# Altium schematic sheet P05_POWER02.SchDoc
size 420 x 297 mm
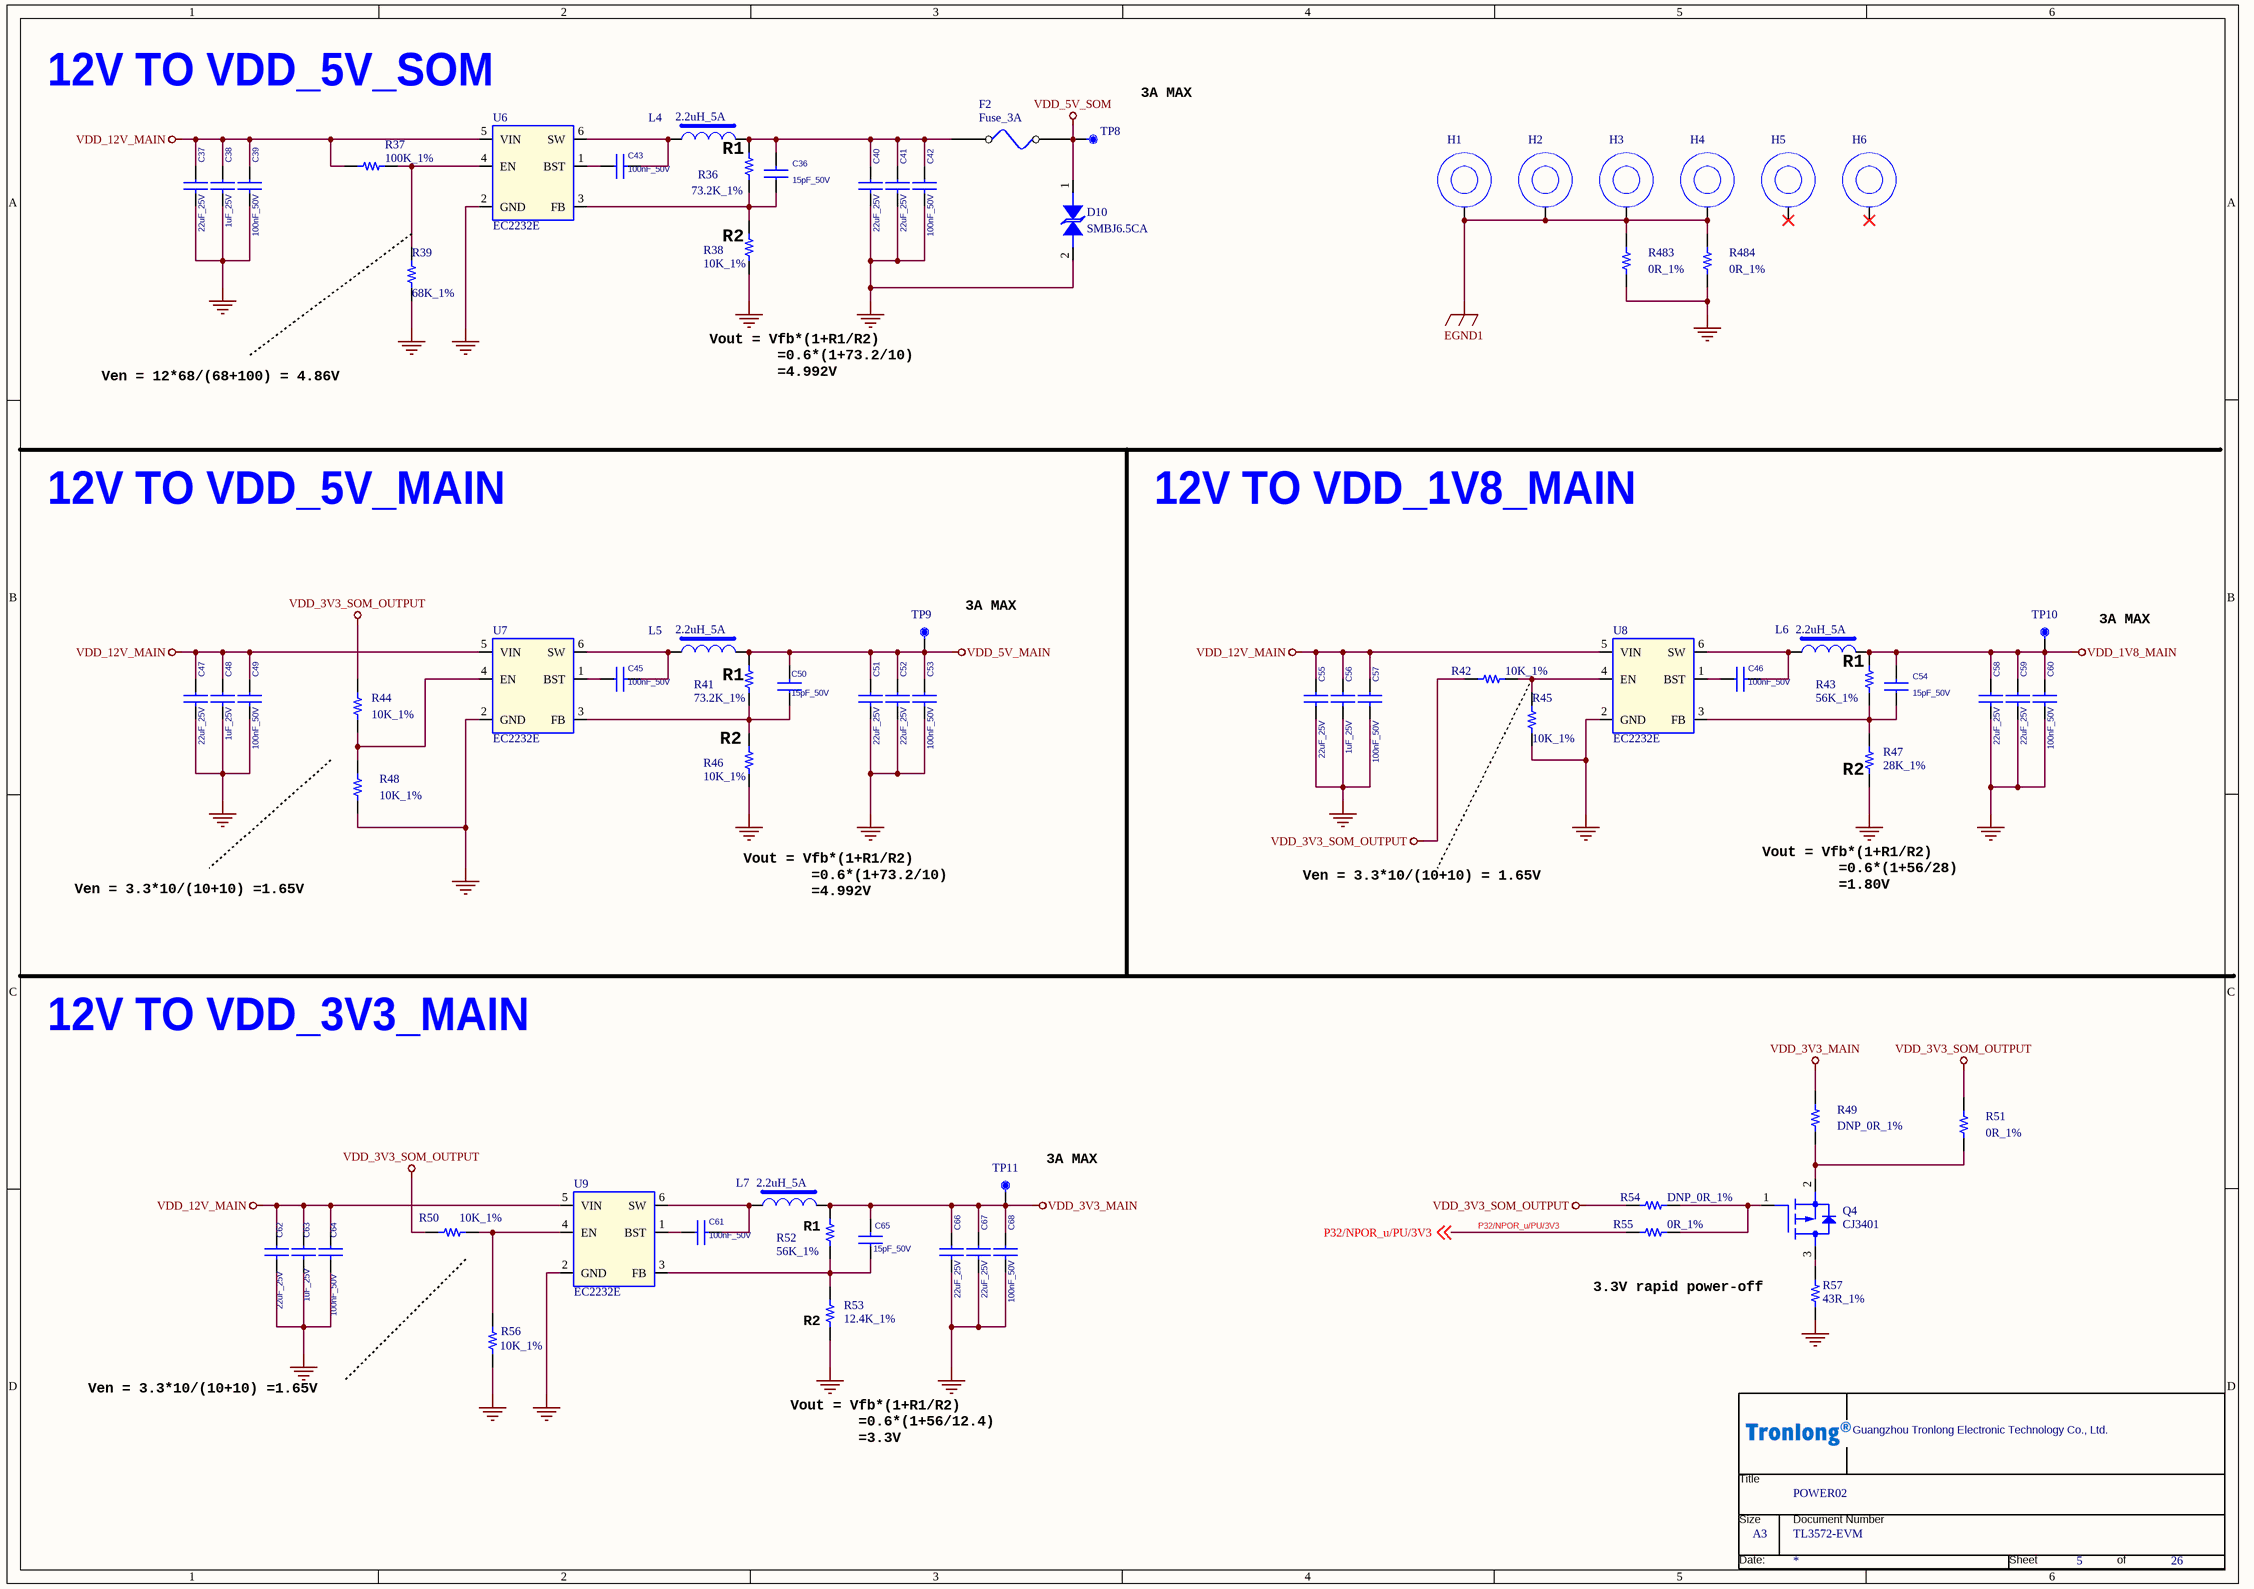
[diagram p0: P05_POWER02.SchDoc]

## Parts
*  Doc: TL3572-EVM  Title: POWER02  OrgName: Guangzhou Tronlong Electronic Technology Co., Ltd.  Page Size: A3  Page Number: 5  Page Count: 26  (hidden comment: Tronlong_TITTLE_20211115)  (graphical)
C36  15pF_50V  [C0603]
C37  22uF_25V  [C0805]
C38  1uF_25V  [C0402]
C39  100nF_50V  [C0402]
C40  22uF_25V  [C0805]
C41  22uF_25V  [C0805]
C42  100nF_50V  [C0402]
C43  100nF_50V  [C0402]
C45  100nF_50V  [C0402]
C46  100nF_50V  [C0402]
C47  22uF_25V  [C0805]
C48  1uF_25V  [C0402]
C49  100nF_50V  [C0402]
C50  15pF_50V  [C0603]
C51  22uF_25V  [C0805]
C52  22uF_25V  [C0805]
C53  100nF_50V  [C0402]
C54  15pF_50V  [C0603]
C55  22uF_25V  [C0805]
C56  1uF_25V  [C0402]
C57  100nF_50V  [C0402]
C58  22uF_25V  [C0805]
C59  22uF_25V  [C0805]
C60  100nF_50V  [C0402]
C61  100nF_50V  [C0402]
C62  22uF_25V  [C0805]
C63  1uF_25V  [C0402]
C64  100nF_50V  [C0402]
C65  15pF_50V  [C0603]
C66  22uF_25V  [C0805]
C67  22uF_25V  [C0805]
C68  100nF_50V  [C0402]
D10  SMBJ6.5CA  [SMB]
F2  Fuse_3A  [F1206]
H1  HOLE  [MHOLE_C200D125]  (value not drawn)
H2  HOLE  [MHOLE_C200D125]  (value not drawn)
H3  HOLE  [MHOLE_C200D125]  (value not drawn)
H4  HOLE  [MHOLE_C200D125]  (value not drawn)
H5  HOLE  [MHOLE_C200D125]  (value not drawn)
H6  HOLE  [MHOLE_C200D125]  (value not drawn)
L4  2.2uH_5A  [SMD-L4040M-2P]
L5  2.2uH_5A  [SMD-L4040M-2P]
L6  2.2uH_5A  [SMD-L4040M-2P]
L7  2.2uH_5A  [SMD-L4040M-2P]
Q4  CJ3401  [SOT23-3]
R36  73.2K_1%  [R0402]
R37  100K_1%  [R0402]
R38  10K_1%  [R0402]
R39  68K_1%  [R0402]
R41  73.2K_1%  [R0402]
R42  10K_1%  [R0402]
R43  56K_1%  [R0402]
R44  10K_1%  [R0402]
R45  10K_1%  [R0402]
R46  10K_1%  [R0402]
R47  28K_1%  [R0402]
R48  10K_1%  [R0402]
R49  DNP_0R_1%  [R0603]
R50  10K_1%  [R0402]
R51  0R_1%  [R0603]
R52  56K_1%  [R0402]
R53  12.4K_1%  [R0402]
R54  DNP_0R_1%  [R0402]
R55  0R_1%  [R0402]
R56  10K_1%  [R0402]
R57  43R_1%  [R0805]
R483  0R_1%  [R1206]
R484  0R_1%  [R1206]
TP8  SMT TP  [TP30]  (value not drawn)
TP9  SMT TP  [TP30]  (value not drawn)
TP10  SMT TP  [TP30]  (value not drawn)
TP11  SMT TP  [TP30]  (value not drawn)
U6  EC2232E  [SOT-23-6L]
U7  EC2232E  [SOT-23-6L]
U8  EC2232E  [SOT-23-6L]
U9  EC2232E  [SOT-23-6L]

## Nets
EGND1: H1.1 H2.1 H3.1 H4.1 R483.2 R484.2
GND: C37.2 C38.2 C39.2 C40.2 C41.2 C42.2 C47.2 C48.2 C49.2 C51.2 C52.2 C53.2 C55.2 C56.2 C57.2 C58.2 C59.2 C60.2 C62.2 C63.2 C64.2 C66.2 C67.2 C68.2 D10.2 R38.1 R39.1 R45.1 R46.1 R47.1 R48.1 R53.1 R56.1 R57.2 R483.1 R484.1 U6.2(GND) U7.2(GND) U8.2(GND) U9.2(GND)
VDD_1V8_MAIN: C54.2 C58.1 C59.1 C60.1 L6.2 R43.2 TP10.1
VDD_3V3_MAIN: C65.2 C66.1 C67.1 C68.1 L7.2 R49.2 R52.2 TP11.1
VDD_3V3_SOM_OUTPUT: R42.1 R44.2 R50.2 R51.2 R54.2
VDD_5V_MAIN: C50.2 C51.1 C52.1 C53.1 L5.2 R41.2 TP9.1
VDD_5V_SOM: D10.1 F2.2 TP8.1
VDD_12V_MAIN: C37.1 C38.1 C39.1 C47.1 C48.1 C49.1 C55.1 C56.1 C57.1 C62.1 C63.1 C64.1 R37.1 U6.5(VIN) U7.5(VIN) U8.5(VIN) U9.5(VIN)
P32/NPOR_u/PU/3V3: R55.2 ; off-sheet P32/NPOR_u/PU/3V3
NetC36_1: C36.1 R36.1 R38.2 U6.3(FB)
NetC36_2: C36.2 C40.1 C41.1 C42.1 F2.1 L4.2 R36.2
NetC43_1: C43.1 U6.1(BST)
NetC43_2: C43.2 L4.1 U6.6(SW)
NetC45_1: C45.1 U7.1(BST)
NetC45_2: C45.2 L5.1 U7.6(SW)
NetC46_1: C46.1 U8.1(BST)
NetC46_2: C46.2 L6.1 U8.6(SW)
NetC50_1: C50.1 R41.1 R46.2 U7.3(FB)
NetC54_1: C54.1 R43.1 R47.2 U8.3(FB)
NetC61_1: C61.1 U9.1(BST)
NetC61_2: C61.2 L7.1 U9.6(SW)
NetC65_1: C65.1 R52.1 R53.2 U9.3(FB)
NetQ4_1: Q4.1(GATE) R54.1 R55.1
NetQ4_2: Q4.2(SOURCE) R49.1 R51.1
NetQ4_3: Q4.3(DRAIN) R57.1
NetR37_2: R37.2 R39.2 U6.4(EN)
NetR42_2: R42.2 R45.2 U8.4(EN)
NetR44_1: R44.1 R48.2 U7.4(EN)
NetR50_1: R50.1 R56.2 U9.4(EN)

Not connected (* = marked no-connect by the designer): H5 1*; H6 1*

## Notes on the sheet
- 12V TO VDD_5V_SOM
- 3A MAX
- (near L4) R1
- (near R38) R2
- Ven = 12*68/(68+100) = 4.86V
- Vout = Vfb*(1+R1/R2)
  =0.6*(1+73.2/10)
  =4.992V
- 12V TO VDD_5V_MAIN
- 12V TO VDD_1V8_MAIN
- (near TP9) 3A MAX
- (near L6) R1
- R1
- (near R46) R2
- (near R47) R2
- Ven = 3.3*10/(10+10) =1.65V
- Ven = 3.3*10/(10+10) = 1.65V
- Vout = Vfb*(1+R1/R2)
  =0.6*(1+56/28)
  =1.80V
- 12V TO VDD_3V3_MAIN
- (near TP11) 3A MAX
- (near R53) R2
- 3.3V rapid power-off
- Vout = Vfb*(1+R1/R2)
  =0.6*(1+56/12.4)
  =3.3V
- (in symbol Tronlong_TITTLE_20211115) Title; Size; Document Number; Date:; Sheet; of

## Library data of the parts
* = Tronlong_TITTLE_20211115: RevCode: A?; Page Create Date: March  8, 1995; Page Modify Date: *
C36 C50 = CAP NP_Dup2: CL10C150JB8NNNC,CC0603JRNPO9BN150; Manufacturer: 广州创龙; Manufacturer PartNumber: 15pF,5%,C0603,50V,（X7R,X5R,COG,NPO或X7S）; Eco-Label: ROHS; ERP Number: 005.0001.0022.00126; Operation Temperature（℃）: -40~+85(Ta); As-Welded: /; PCB Footprint: C0603; Part Status: -; Manufacturer Character: -; Temperature: -55~125℃
C37 = CAP NP_Dup2: 贴片陶瓷电容,22uF,20%,25V,X5R; Manufacturer Character: 中国大陆; Manufacturer: 广东风华高新科技股份有限公司（FH）; Manufacturer PartNumber: 0805X226M250NT; Eco-Label: ROHS; ERP Number: 005.0001.0001.00524; Operation Temperature（℃）: -55~+85(Ta); As-Welded: /; PCB Footprint: C0805; Part Status: 优选; Temperature: -55~125℃
C38 = CAP NP_Dup2: 贴片陶瓷电容,1uF,10%,25V,X5R; Manufacturer PartNumber: 0402X105K250NT; Manufacturer: 广东风华高新科技股份有限公司（FH）; Manufacturer Character: 中国大陆; Eco-Label: ROHS; ERP Number: 005.0001.0001.00640; As-Welded: /; Operation Temperature（℃）: -55~+85(Ta); PCB Footprint: C0402; Part Status: 试用
C39 C43 = CAP NP_Dup2: 贴片陶瓷电容,100nF,10%,50V,X7R; Manufacturer: 广东风华高新科技股份有限公司（FH）; Manufacturer PartNumber: 0402B104K500NT; Manufacturer Character: 中国大陆; As-Welded: /; Operation Temperature（℃）: -55~+125(Ta); ERP Number: 005.0001.0001.00681; Eco-Label: ROHS; PCB Footprint: C0402; Temperature: -55~125℃; Part Status: 试用
C40 C41 C51 = CAP NP_Dup2: 贴片陶瓷电容,22uF,20%,25V,X5R; Manufacturer Character: 中国大陆; Manufacturer PartNumber: 0805X226M250NT; Manufacturer: 广东风华高新科技股份有限公司（FH）; Eco-Label: ROHS; ERP Number: 005.0001.0001.00524; Operation Temperature（℃）: -55~+85(Ta); As-Welded: /; PCB Footprint: C0805; Part Status: 优选; Temperature: -55~125℃
C42 C49 C53 = CAP NP_Dup2: 贴片陶瓷电容,100nF,10%,50V,X7R; Manufacturer Character: 中国大陆; Manufacturer: 广东风华高新科技股份有限公司（FH）; Manufacturer PartNumber: 0402B104K500NT; As-Welded: /; Operation Temperature（℃）: -55~+125(Ta); ERP Number: 005.0001.0001.00681; Eco-Label: ROHS; PCB Footprint: C0402; Temperature: -55~125℃; Part Status: 试用
C45 = CAP NP_Dup2: 贴片陶瓷电容,100nF,10%,50V,X7R; Manufacturer Character: 中国大陆; Manufacturer PartNumber: 0402B104K500NT; Manufacturer: 广东风华高新科技股份有限公司（FH）; As-Welded: /; Operation Temperature（℃）: -55~+125(Ta); ERP Number: 005.0001.0001.00681; Eco-Label: ROHS; PCB Footprint: C0402; Temperature: -55~125℃; Part Status: 试用
C46 = CAP NP_Dup2: 贴片陶瓷电容,100nF,10%,50V,X7R; Manufacturer Character: 中国大陆; Manufacturer: 广东风华高新科技股份有限公司（FH）; Manufacturer PartNumber: 0402B104K500NT; Eco-Label: ROHS; ERP Number: 005.0001.0001.00681; Characteristic: <Characteristic>; Operation Temperature（℃）: -55~+125(Ta); As-Welded: /; PCB Footprint: C0402; Temperature: -55~155℃; Part Status: 试用
C47 C52 = CAP NP_Dup2: 贴片陶瓷电容,22uF,20%,25V,X5R; Manufacturer: 广东风华高新科技股份有限公司（FH）; Manufacturer PartNumber: 0805X226M250NT; Manufacturer Character: 中国大陆; Eco-Label: ROHS; ERP Number: 005.0001.0001.00524; Operation Temperature（℃）: -55~+85(Ta); As-Welded: /; PCB Footprint: C0805; Part Status: 优选; Temperature: -55~125℃
C48 = CAP NP_Dup2: 贴片陶瓷电容,1uF,10%,25V,X5R; Manufacturer Character: 中国大陆; Manufacturer PartNumber: 0402X105K250NT; Manufacturer: 广东风华高新科技股份有限公司（FH）; Eco-Label: ROHS; ERP Number: 005.0001.0001.00640; As-Welded: /; Operation Temperature（℃）: -55~+85(Ta); PCB Footprint: C0402; Part Status: 试用
C54 = CAP NP_Dup2: CL10C150JB8NNNC,CC0603JRNPO9BN150; Manufacturer PartNumber: 15pF,5%,C0603,50V,（X7R,X5R,COG,NPO或X7S）; Manufacturer: 广州创龙; As-Welded: /; Operation Temperature（℃）: -40~+85(Ta); ERP Number: 005.0001.0022.00126; Eco-Label: ROHS; PCB Footprint: C0603; Part Status: -; Temperature: -55~125℃; Manufacturer Character: -
C55 = CAP NP_Dup2: 贴片陶瓷电容,22uF,20%,25V,X5R; Manufacturer: 广东风华高新科技股份有限公司（FH）; Manufacturer PartNumber: 0805X226M250NT; Manufacturer Character: 中国大陆; As-Welded: /; Operation Temperature（℃）: -55~+85(Ta); Characteristic: <Characteristic>; ERP Number: 005.0001.0001.00524; Eco-Label: ROHS; PCB Footprint: C0805; Part Status: 优选; Temperature: -55~155℃
C56 = CAP NP_Dup2: 贴片陶瓷电容,1uF,10%,25V,X5R; Manufacturer PartNumber: 0402X105K250NT; Manufacturer: 广东风华高新科技股份有限公司（FH）; Manufacturer Character: 中国大陆; As-Welded: /; Operation Temperature（℃）: -55~+85(Ta); Characteristic: <Characteristic>; ERP Number: 005.0001.0001.00640; Eco-Label: ROHS; PCB Footprint: C0402; Part Status: 试用
C57 C60 = CAP NP_Dup2: 贴片陶瓷电容,100nF,10%,50V,X7R; Manufacturer PartNumber: 0402B104K500NT; Manufacturer: 广东风华高新科技股份有限公司（FH）; Manufacturer Character: 中国大陆; Eco-Label: ROHS; ERP Number: 005.0001.0001.00681; Operation Temperature（℃）: -55~+125(Ta); Characteristic: <Characteristic>; As-Welded: /; PCB Footprint: C0402; Temperature: -55~155℃; Part Status: 试用
C58 C59 = CAP NP_Dup2: 贴片陶瓷电容,22uF,20%,25V,X5R; Manufacturer: 广东风华高新科技股份有限公司（FH）; Manufacturer PartNumber: 0805X226M250NT; Manufacturer Character: 中国大陆; As-Welded: /; Operation Temperature（℃）: -55~+85(Ta); ERP Number: 005.0001.0001.00524; Eco-Label: ROHS; PCB Footprint: C0805; Part Status: 优选; Temperature: -55~125℃
C61 = CAP NP_Dup2: 贴片陶瓷电容,100nF,10%,50V,X7R; Manufacturer Character: 中国大陆; Manufacturer PartNumber: 0402B104K500NT; Manufacturer: 广东风华高新科技股份有限公司（FH）; Eco-Label: ROHS; ERP Number: 005.0001.0001.00681; Operation Temperature（℃）: -55~+125(Ta); As-Welded: /; PCB Footprint: C0402; Temperature: -55~125℃; Part Status: 试用
C62 C66 C67 = CAP NP_Dup2: 贴片陶瓷电容,22uF,20%,25V,X5R; Manufacturer Character: 中国大陆; Manufacturer PartNumber: 0805X226M250NT; Manufacturer: 广东风华高新科技股份有限公司（FH）; As-Welded: /; Operation Temperature（℃）: -55~+85(Ta); ERP Number: 005.0001.0001.00524; Eco-Label: ROHS; PCB Footprint: C0805; Part Status: 优选; Temperature: -55~125℃
C63 = CAP NP_Dup2: 贴片陶瓷电容,1uF,10%,25V,X5R; Manufacturer PartNumber: 0402X105K250NT; Manufacturer: 广东风华高新科技股份有限公司（FH）; Manufacturer Character: 中国大陆; As-Welded: /; Operation Temperature（℃）: -55~+85(Ta); ERP Number: 005.0001.0001.00640; Eco-Label: ROHS; PCB Footprint: C0402; Part Status: 试用
C64 = CAP NP_Dup2: 贴片陶瓷电容,100nF,10%,50V,X7R; Manufacturer Character: 中国大陆; Manufacturer: 广东风华高新科技股份有限公司（FH）; Manufacturer PartNumber: 0402B104K500NT; Eco-Label: ROHS; ERP Number: 005.0001.0001.00681; Operation Temperature（℃）: -55~+125(Ta); As-Welded: /; PCB Footprint: C0402; Temperature: -55~125℃; Part Status: 试用
C65 = CAP NP_Dup2: CL10C150JB8NNNC,CC0603JRNPO9BN150; Manufacturer: 广州创龙; Manufacturer PartNumber: 15pF,5%,C0603,50V,（X7R,X5R,COG,NPO或X7S）; As-Welded: /; Operation Temperature（℃）: -40~+85(Ta); ERP Number: 005.0001.0022.00126; Eco-Label: ROHS; PCB Footprint: C0603; Part Status: -; Manufacturer Character: -; Temperature: -55~125℃
C68 = CAP NP_Dup2: 贴片陶瓷电容,100nF,10%,50V,X7R; Manufacturer PartNumber: 0402B104K500NT; Manufacturer: 广东风华高新科技股份有限公司（FH）; Manufacturer Character: 中国大陆; Eco-Label: ROHS; ERP Number: 005.0001.0001.00681; Operation Temperature（℃）: -55~+125(Ta); As-Welded: /; PCB Footprint: C0402; Temperature: -55~125℃; Part Status: 试用
D10 = DIODE TVS BI-DIR: TVS二极管,VRWM=6.5V,VBR=7.22V,一组,双向; Manufacturer Character: 中国大陆; Manufacturer: 上海雷卯电子科技有限公司（Leiditech）; Operation Temperature（℃）: -55~+150(Tj); room: 6; ERP Number: 005.0001.0017.00087; Eco-Label: ROHS; As-Welded: /; PCB Footprint: SMB; Manufacturer PartNumber: SMBJ6.5CA; Part Status: 测评
F2 = FUSE: 保险丝，Vmax=72V,Imax=50A,Ihold=3A; Manufacturer Character: 中国大陆; Manufacturer: 东莞市竞沃电子科技有限公司（TLC）; Manufacturer PartNumber: F12T3; Eco-Label: ROHS; ERP Number: 005.0001.0011.00036; Operation Temperature（℃）: -55~+125(Ta); As-Welded: /; PCB Footprint: F1206; Part Status: 试用; Temperature: -55~125℃
H1-H6 = HOLE: Manufacturer Character: 中国大陆; Operation Temperature（℃）: /; As-Welded: DNP; PCB Footprint: MHOLE_C200D125
L4 = INDUCTOR: 贴片功率电感,2.2uH,0.048Ω,Isat=7.6A,Irms=5A; Manufacturer Character: 中国大陆; Manufacturer: 深圳顺络电子股份有限公司（Sunlord）; Manufacturer PartNumber: WPN4020H2R2MT; Parameter: L2520，奇力新一体成型电感，最大额定电流3A，内阻65毫欧，20%; Eco-Label: ROHS; ERP Number: 005.0001.0006.00163; As-Welded: /; Operation Temperature（℃）: -40~+125(Ta); PCB Footprint: SMD-L4040M-2P; Part Status: 试用; Temperature: -40~125℃
L5 = INDUCTOR: 贴片功率电感,2.2uH,0.048Ω,Isat=7.6A,Irms=5A; Manufacturer PartNumber: WPN4020H2R2MT; Manufacturer: 深圳顺络电子股份有限公司（Sunlord）; Manufacturer Character: 中国大陆; Parameter: L2520，奇力新一体成型电感，最大额定电流3A，内阻65毫欧，20%; Eco-Label: ROHS; ERP Number: 005.0001.0006.00163; Operation Temperature（℃）: -40~+125(Ta); As-Welded: /; PCB Footprint: SMD-L4040M-2P; Part Status: 试用; Temperature: -40~125℃
L6 L7 = INDUCTOR: 贴片功率电感,2.2uH,0.048Ω,Isat=7.6A,Irms=5A; Manufacturer PartNumber: WPN4020H2R2MT; Manufacturer: 深圳顺络电子股份有限公司（Sunlord）; Manufacturer Character: 中国大陆; Parameter: L2520，奇力新一体成型电感，最大额定电流3A，内阻65毫欧，20%; Operation Temperature（℃）: -40~+125(Ta); As-Welded: /; ERP Number: 005.0001.0006.00163; Eco-Label: ROHS; PCB Footprint: SMD-L4040M-2P; Part Status: 试用; Temperature: -40~125℃
Q4 = MOSFET P SOT: MOSFET,P沟道,VDSS=-30V,VGSS=±12V,ID=-4.2A,PD=0.35W,VGS(th)=-1.3V; Manufacturer Character: 中国大陆; Manufacturer: 江苏长晶科技股份有限公司（JSCJ）; As-Welded: /; Operation Temperature（℃）: -55~+150(Tj); room: DCIN; ERP Number: 005.0001.0009.00015; Eco-Label: ROHS; PCB Footprint: SOT23-3; Manufacturer PartNumber: CJ3401; Manufacturer Part Number: CJ3401; Temperature: -55~150℃; Part Status: 优选
R36 = Resistor_Dup3: RC0402FR-0773K2L,0402WGF7322TCE,RTT027322FTH; Manufacturer: 广州创龙; Manufacturer PartNumber: 73.2K,±1%,R0402,≥1/16W; CLASS: DISCRETE; As-Welded: /; Operation Temperature（℃）: -40~+85(Ta); ERP Number: 005.0001.0023.00234; Eco-Label: ROHS; PCB Footprint: R0402; Part Status: -; Temperature: -55~155℃; Manufacturer Character: -
R37 = Resistor_Dup3: RC0402FR-07100KL,0402WGF1003TCE; Manufacturer: 广州创龙; Manufacturer PartNumber: 100K,±1%,R0402,≥1/16W; CLASS: DISCRETE; Eco-Label: ROHS; ERP Number: 005.0001.0023.00025; Operation Temperature（℃）: -40~+85(Ta); As-Welded: /; PCB Footprint: R0402; Part Status: -; Manufacturer Character: -; Temperature: -55~155℃
R38 R44-R46 R48 = Resistor_Dup3: 贴片电阻,10K,±1%,1/16W; Manufacturer PartNumber: RC-02K1002FT; Manufacturer: 广东风华高新科技股份有限公司（FH）; Manufacturer Character: 中国大陆; CLASS: DISCRETE; Eco-Label: ROHS; ERP Number: 005.0001.0002.01326; Operation Temperature（℃）: -55~+125(Ta); As-Welded: /; PCB Footprint: R0402; Part Status: 优选
  R38 R45 R46: Temperature: -55~155℃
  R44 R48: Temperature: –55~155℃
R39 = Resistor_Dup3: 贴片电阻,68K,±1%,1/16W; Manufacturer Character: 中国大陆; Manufacturer PartNumber: RC-02K6802FT; Manufacturer: 广东风华高新科技股份有限公司（FH）; CLASS: DISCRETE; Eco-Label: ROHS; ERP Number: 005.0001.0002.01426; Operation Temperature（℃）: -55~+155(Ta); As-Welded: /; PCB Footprint: R0402; Part Status: 测评; Temperature: -55~155℃
R41 = Resistor_Dup3: RC0402FR-0773K2L,0402WGF7322TCE,RTT027322FTH; Manufacturer PartNumber: 73.2K,±1%,R0402,≥1/16W; Manufacturer: 广州创龙; CLASS: DISCRETE; Eco-Label: ROHS; ERP Number: 005.0001.0023.00234; Operation Temperature（℃）: -40~+85(Ta); As-Welded: /; PCB Footprint: R0402; Part Status: -; Manufacturer Character: -; Temperature: -55~155℃
R42 = Resistor_Dup3: 贴片电阻,10K,±1%,1/16W; Manufacturer PartNumber: RC-02K1002FT; Manufacturer: 广东风华高新科技股份有限公司（FH）; Manufacturer Character: 中国大陆; CLASS: DISCRETE; As-Welded: /; Operation Temperature（℃）: -55~+125(Ta); ERP Number: 005.0001.0002.01326; Eco-Label: ROHS; PCB Footprint: R0402; Part Status: 优选; Temperature: -55~155℃
R43 = Resistor_Dup3: RC0402FR-0756KL，0402WGF5602TCE; Manufacturer: 广州创龙; Manufacturer PartNumber: 56K,±1%,R0402,≥1/16W; CLASS: DISCRETE; As-Welded: /; Operation Temperature（℃）: -40~+85(Ta); ERP Number: 005.0001.0023.00207; Eco-Label: ROHS; PCB Footprint: R0402; Part Status: -; Temperature: -55~155℃; Manufacturer Character: -
R47 = Resistor_Dup3: 贴片电阻,28K,±1%,1/16W; Manufacturer PartNumber: RC-02K2802FT; Manufacturer: 广东风华高新科技股份有限公司（FH）; Manufacturer Character: 中国大陆; CLASS: DISCRETE; As-Welded: /; Operation Temperature（℃）: -55~+155(Ta); ERP Number: 005.0001.0002.01380; Eco-Label: ROHS; PCB Footprint: R0402; Part Status: 试用; Temperature: -55~155℃
R49 = Resistor_Dup3: 贴片电阻,0R,±1%,1/10W; Manufacturer Character: 中国大陆; Manufacturer PartNumber: RS-03000FT; Manufacturer: 广东风华高新科技股份有限公司（FH）; CLASS: DISCRETE; Eco-Label: ROHS; ERP Number: 005.0001.0002.00956; Operation Temperature（℃）: -55~+155(Ta); room: RS232; As-Welded: DNP; PCB Footprint: R0603; Part Status: 优选
R50 = Resistor_Dup3: 贴片电阻,10K,±1%,1/16W; Manufacturer Character: 中国大陆; Manufacturer PartNumber: RC-02K1002FT; Manufacturer: 广东风华高新科技股份有限公司（FH）; CLASS: DISCRETE; Eco-Label: ROHS; ERP Number: 005.0001.0002.01326; Operation Temperature（℃）: -55~+125(Ta); As-Welded: /; PCB Footprint: R0402; Temperature: –55~155℃; Part Status: 优选
R51 = Resistor_Dup3: 贴片电阻,0R,±1%,1/10W; Manufacturer: 广东风华高新科技股份有限公司（FH）; Manufacturer PartNumber: RS-03000FT; Manufacturer Character: 中国大陆; CLASS: DISCRETE; As-Welded: /; room: RS232; Operation Temperature（℃）: -55~+155(Ta); ERP Number: 005.0001.0002.00956; Eco-Label: ROHS; PCB Footprint: R0603; Part Status: 优选
R52 = Resistor_Dup3: RC0402FR-0756KL，0402WGF5602TCE; Manufacturer PartNumber: 56K,±1%,R0402,≥1/16W; Manufacturer: 广州创龙; CLASS: DISCRETE; As-Welded: /; Operation Temperature（℃）: -40~+85(Ta); ERP Number: 005.0001.0023.00207; Eco-Label: ROHS; PCB Footprint: R0402; Part Status: -; Manufacturer Character: -; Temperature: -55~155℃
R53 = Resistor_Dup3: 0402WGF1242TCE; Manufacturer PartNumber: 12.4K,±1%,R0402,≥1/16W; Manufacturer: 广州创龙; CLASS: DISCRETE; Eco-Label: ROHS; ERP Number: 005.0001.0023.00040; Operation Temperature（℃）: -40~+85(Ta); As-Welded: /; PCB Footprint: R0402; Manufacturer Character: -; Temperature: -55~155℃; Part Status: -
R54 = Resistor_Dup3: 贴片电阻,0R,±1%,1/16W; Manufacturer: 广东风华高新科技股份有限公司（FH）; Manufacturer PartNumber: RC-02000FT; Manufacturer Character: 中国大陆; CLASS: DISCRETE; Operation Temperature（℃）: -55~+155(Ta); As-Welded: DNP; ERP Number: 005.0001.0002.00938; Eco-Label: ROHS; PCB Footprint: R0402; Part Status: 优选
R55 = Resistor_Dup3: 贴片电阻,0R,±1%,1/16W; Manufacturer: 广东风华高新科技股份有限公司（FH）; Manufacturer PartNumber: RC-02000FT; Manufacturer Character: 中国大陆; CLASS: DISCRETE; Operation Temperature（℃）: -55~+155(Ta); As-Welded: /; ERP Number: 005.0001.0002.00938; Eco-Label: ROHS; PCB Footprint: R0402; Part Status: 优选
R56 = Resistor_Dup3: 贴片电阻,10K,±1%,1/16W; Manufacturer: 广东风华高新科技股份有限公司（FH）; Manufacturer PartNumber: RC-02K1002FT; Manufacturer Character: 中国大陆; CLASS: DISCRETE; As-Welded: /; Operation Temperature（℃）: -55~+125(Ta); ERP Number: 005.0001.0002.01326; Eco-Label: ROHS; PCB Footprint: R0402; Part Status: 优选; Temperature: –55~155℃
R57 = Resistor_Dup3: 贴片电阻,43R,±1%,1/8W; Manufacturer Character: 中国大陆; Manufacturer PartNumber: RS-05K43R0FT; Manufacturer: 广东风华高新科技股份有限公司（FH）; CLASS: DISCRETE; As-Welded: /; Operation Temperature（℃）: -55~+125(Ta); room: DCIN; ERP Number: 005.0001.0002.01306; Eco-Label: ROHS; PCB Footprint: R0805; Temperature: -55~155℃; Part Status: 试用
R483 = Resistor_Dup3: 贴片电阻,0R,±1%,1/4W; Manufacturer: 广东风华高新科技股份有限公司（FH）; Manufacturer PartNumber: RS-06000FT; Manufacturer Character: 中国大陆; CLASS: DISCRETE; ERP Number: 005.0001.0002.01440; Operation Temperature（℃）: -55~+155(Ta); room: USB HUB; As-Welded: /; Eco-Label: ROHS; PCB Footprint: R1206; Part Status: 测评
R484 = Resistor_Dup3: 贴片电阻,0R,±1%,1/4W; Manufacturer Character: 中国大陆; Manufacturer PartNumber: RS-06000FT; Manufacturer: 广东风华高新科技股份有限公司（FH）; CLASS: DISCRETE; Eco-Label: ROHS; As-Welded: /; room: USB HUB; Operation Temperature（℃）: -55~+155(Ta); ERP Number: 005.0001.0002.01440; PCB Footprint: R1206; Part Status: 测评
TP8-TP11 = TP-S40: /; Manufacturer Character: 中国大陆; Characteristic: Test point,diameter=1.0mm; As-Welded: DNP; PCB Footprint: TP30; Operation Temperature（℃）: /; Manufacturer: /; Manufacturer PartNumber: /
U6 U9 = WD1304E30: DC/DC,Buck,Vin:4.5V~17V,Vout:0.6V~6V,3A,1·; Manufacturer Character: 中国大陆; Manufacturer: 上海芯强微电子股份有限公司（Ecranic）; As-Welded: /; Operation Temperature（℃）: -40~+85(Ta); ERP Number: 005.0001.0004.00889; Eco-Label: ROHS; PCB Footprint: SOT-23-6L; Temperature: -40~85℃; Manufacturer PartNumber: EC2232E; Part Status: 试用
U7 = WD1304E30: DC/DC,Buck,Vin:4.5V~17V,Vout:0.6V~6V,3A,1·; Manufacturer Character: 中国大陆; Manufacturer: 上海芯强微电子股份有限公司（Ecranic）; Eco-Label: ROHS; ERP Number: 005.0001.0004.00889; Operation Temperature（℃）: -40~+85(Ta); As-Welded: /; PCB Footprint: SOT-23-6L; Part Status: 试用; Temperature: -40~85℃; Manufacturer PartNumber: EC2232E
U8 = WD1304E30_0_Dup1: DC/DC,Buck,Vin:4.5V~17V,Vout:0.6V~6V,3A,1·; Manufacturer: 上海芯强微电子股份有限公司（Ecranic）; Manufacturer Character: 中国大陆; As-Welded: /; Operation Temperature（℃）: -40~+85(Ta); ERP Number: 005.0001.0004.00889; Eco-Label: ROHS; PCB Footprint: SOT-23-6L; Part Status: 试用; Manufacturer PartNumber: EC2232E; Temperature: -40~125℃